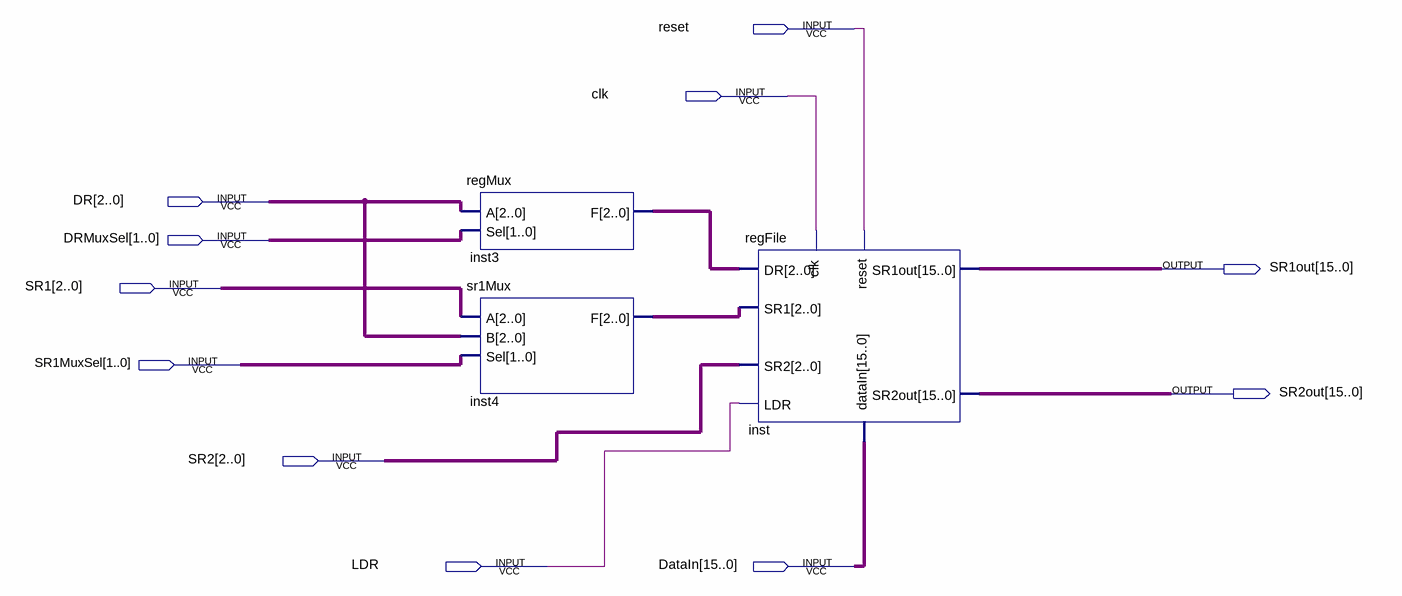
[diagram p0: schematic sheet]
// Quartus schematic regStruct.bdf as structural Verilog: 3 symbols, 11 pins
module regStruct (
  input  reset,
  input  clk,
  input  [2:0] DR,
  input  [1:0] DRMuxSel,
  input  [2:0] SR1,
  input  [1:0] SR1MuxSel,
  input  [2:0] SR2,
  input  LDR,
  input  [15:0] DataIn,
  output [15:0] SR1out,
  output [15:0] SR2out
);

  wire [2:0] inst3_f, inst4_f;

  regMux inst3 (.A(DR), .Sel(DRMuxSel), .F(inst3_f));
  sr1Mux inst4 (.A(SR1), .B(DR), .Sel(SR1MuxSel), .F(inst4_f));
  regFile inst (
    .dataIn(DataIn), .DR(inst3_f), .SR1(inst4_f), .SR2(SR2), .LDR(LDR), .clk(clk), .reset(reset),
    .SR1out(SR1out), .SR2out(SR2out));
endmodule
